# Altium schematic sheet LEDs.SchDoc
size A
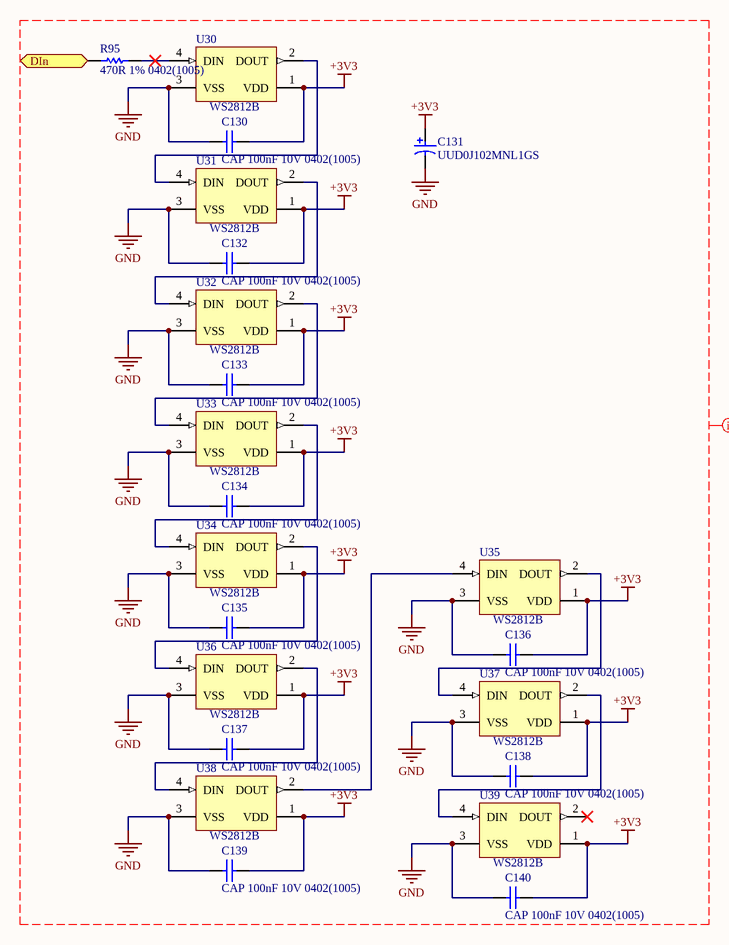
[diagram p0: LEDs.SchDoc]

## Parts
C130  CAP 100nF 10V 0402(1005)  [CAPC0402(1005)60_L]
C131  UUD0J102MNL1GS  [NIC-CAPA2-8X10_V]
C132  CAP 100nF 10V 0402(1005)  [CAPC0402(1005)60_L]
C133  CAP 100nF 10V 0402(1005)  [CAPC0402(1005)60_L]
C134  CAP 100nF 10V 0402(1005)  [CAPC0402(1005)60_L]
C135  CAP 100nF 10V 0402(1005)  [CAPC0402(1005)60_L]
C136  CAP 100nF 10V 0402(1005)  [CAPC0402(1005)60_L]
C137  CAP 100nF 10V 0402(1005)  [CAPC0402(1005)60_L]
C138  CAP 100nF 10V 0402(1005)  [CAPC0402(1005)60_L]
C139  CAP 100nF 10V 0402(1005)  [CAPC0402(1005)60_L]
C140  CAP 100nF 10V 0402(1005)  [CAPC0402(1005)60_L]
R95  470R 1% 0402(1005)  [RESC0402(1005)_L]
U30  WS2812B  [ADAI-WS2812B_V]
U31  WS2812B  [ADAI-WS2812B_V]
U32  WS2812B  [ADAI-WS2812B_V]
U33  WS2812B  [ADAI-WS2812B_V]
U34  WS2812B  [ADAI-WS2812B_V]
U35  WS2812B  [ADAI-WS2812B_V]
U36  WS2812B  [ADAI-WS2812B_V]
U37  WS2812B  [ADAI-WS2812B_V]
U38  WS2812B  [ADAI-WS2812B_V]
U39  WS2812B  [ADAI-WS2812B_V]

## Ports
DIn (in)

## Nets
+3V3: C130.1 C131.1 C132.1 C133.1 C134.1 C135.1 C136.1 C137.1 C138.1 C139.1 C140.1 U30.1(VDD) U31.1(VDD) U32.1(VDD) U33.1(VDD) U34.1(VDD) U35.1(VDD) U36.1(VDD) U37.1(VDD) U38.1(VDD) U39.1(VDD)
GND: C130.2 C131.2 C132.2 C133.2 C134.2 C135.2 C136.2 C137.2 C138.2 C139.2 C140.2 U30.3(VSS) U31.3(VSS) U32.3(VSS) U33.3(VSS) U34.3(VSS) U35.3(VSS) U36.3(VSS) U37.3(VSS) U38.3(VSS) U39.3(VSS)
DIn: R95.1 ; port DIn
NetR95_2: R95.2 U30.4(DIN)
NetU30_2: U30.2(DOUT) U31.4(DIN)
NetU31_2: U31.2(DOUT) U32.4(DIN)
NetU32_2: U32.2(DOUT) U33.4(DIN)
NetU33_2: U33.2(DOUT) U34.4(DIN)
NetU34_2: U34.2(DOUT) U36.4(DIN)
NetU35_2: U35.2(DOUT) U37.4(DIN)
NetU35_4: U35.4(DIN) U38.2(DOUT)
NetU36_2: U36.2(DOUT) U38.4(DIN)
NetU37_2: U37.2(DOUT) U39.4(DIN)

Not connected (* = marked no-connect by the designer): U39 2(DOUT)*

## Layout directives
net class LEDs: +3V3, GND

## Library data of the parts
C130 C132-C140 = CMP-1034-02066-1: CAP 100nF 10V ±20% 0402 (1005 Metric) Thickness 0.6mm SMD; Tolerance: Â±20%; Case-Metric: 1005; Case-EIA: 0402; Max Thickness: 0.6 mm; Rated Voltage: 10 V; Technology: SMT; Value: 100nF
C131 = CMP-0687-00071-1: Aluminum Electrolytic Capacitor, UD Series, Low Impedance, 1000 uF, 6.3 V, + / - 20%, -55 to 105 degC, Chip Type, 8 x 10 mm D x L, Pb-Free, Reel; Manufacturer: Nichicon; Impedance: 0.17 Ohm; Endurance Time: 5000 h; Rated Capacitance: 1000 uF; Rated Ripple Current (at 100kHz): 450 mA; Rated Voltage: 6.3 V; Packing: Dia382mm Reel; Tolerance Rated Capacitance: -20 to 20%; Diameter: 8 mm; ComponentLink3Description: Package Specification; Mounting Technology: Surface Mount; RoHS: TRUE; ComponentLink3URL: http://products.nichicon.co.jp/en/pdf/XJA043/e-ud.pdf; Length: 10 mm; PackageDescription: 2-Pin Surface Mount Device, Diameter 8 mm, Height 10 mm, Pitch 6.5 mm; DatasheetVersion: 08/2012; ComponentLink2Description: Datasheet; PartNumber: UUD0J102MNL1GS; ComponentLink1URL: http://www.nichicon.co.jp/; ComponentLink1Description: Manufacturer URL; ComponentLink2URL: http://products.nichicon.co.jp/en/pdf/XJA043/e-ud.pdf; PackageReference: CAPAE-D8H10
R95 = CMP-1011-00473-1: 470R 0.063W 1% 0402 (1005 Metric)  SMD; Case-Metric: 1005; Case-EIA: 0402; Value: 470.00 Ohm; Tolerance: 1 %; Technology: SMT; Power: 0.063 W
U30-U39 = CMP-1740-00005-1: Intelligent Control LED Integrated Light Source, 3.5 to 5.3 V, -25 to 80 degC, 4-Pin SMD, RoHS, Bulk; Case\Package: Radial; Shielding: Unshielded; Current Rating: 240 mA; Tolerance: 10%; Mount: Through Hole; Max Operating Temperature: 125 degC; Radiation Hardening: No; Length: 12.2 mm; Min Operating Temperature: -55 degC; ComponentLink1URL: https://www.adafruit.com/; Packaging: Bulk; Lead Pitch: 5 mm; RoHSCompliant: true; Pins: 2; Package Quantity: 200; ComponentLink2URL: https://cdn-shop.adafruit.com/datasheets/WS2812B.pdf; ComponentLink2Description: Datasheet; PackageDescription: 4-Pin Surface Mount Device, Body 5 x 5 mm, Pitch 3.3 mm; PackageReference: WS2812B; Height: 12.2 mm; REACH SVHC: No SVHC; ComponentLink1Description: Manufacturer URL; DatasheetVersion: May-13